# Altium schematic sheet STLINK-V2.SchDoc
size A
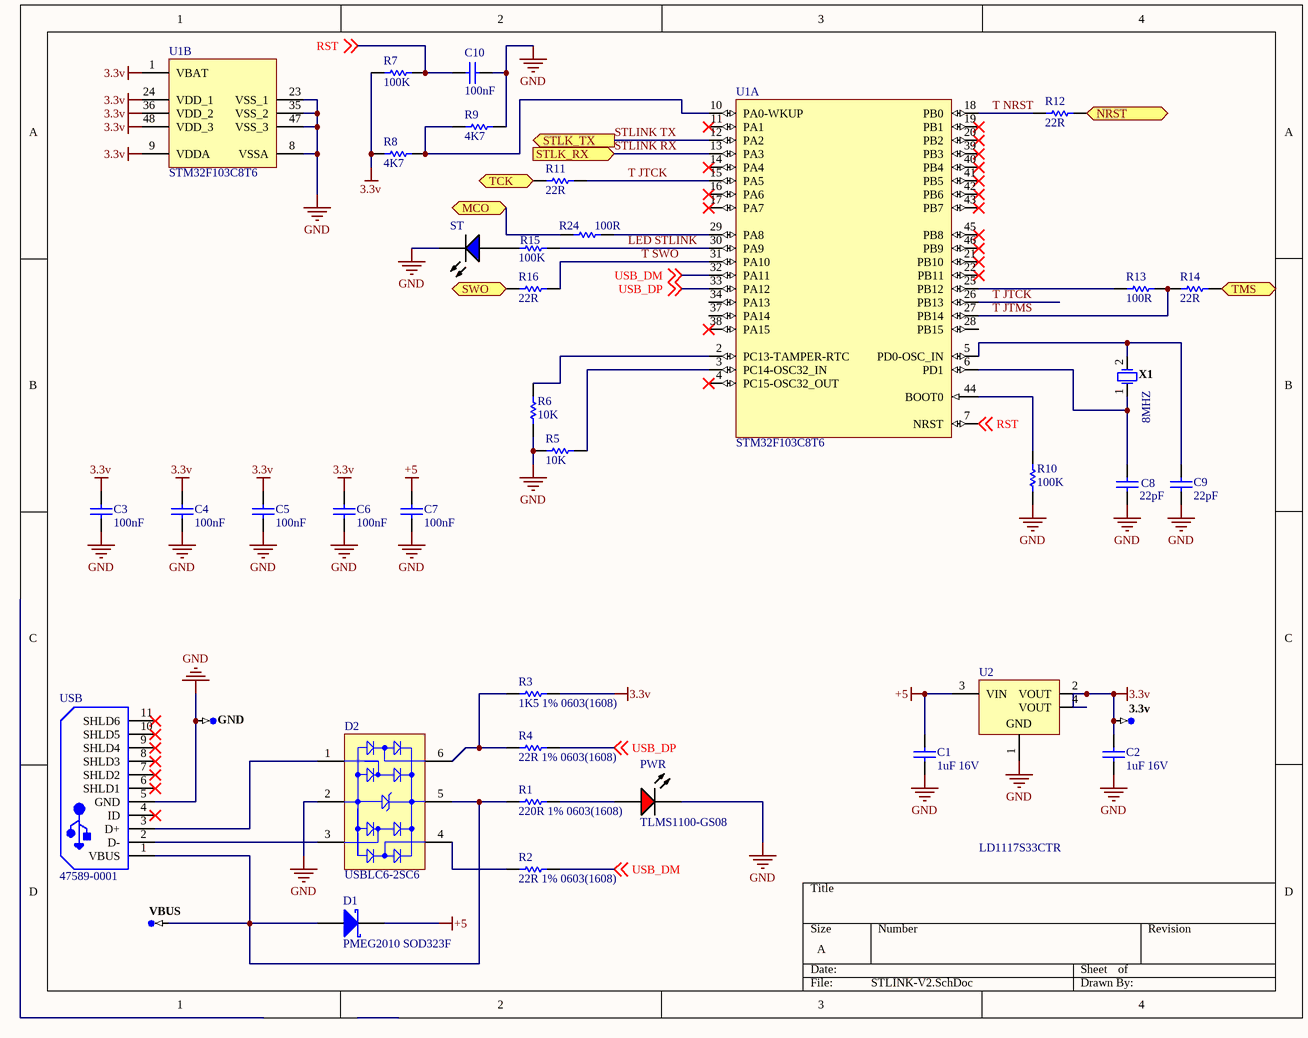
[diagram p0: STLINK-V2.SchDoc]

## Parts
3.3v  (no value)  [TP-SM-C-100]  (no BOM)
C1  1uF 16V  [CAPC0603(1608)100_L]
C2  1uF 16V  [CAPC0603(1608)100_L]
C3  100nF  [CAPC0603(1608)100_L]
C4  100nF  [CAPC0603(1608)100_L]
C5  100nF  [CAPC0603(1608)100_L]
C6  100nF  [CAPC0603(1608)100_L]
C7  100nF  [CAPC0603(1608)100_L]
C8  22pF  [CAPC0603(1608)100_L]
C9  22pF  [CAPC0603(1608)100_L]
C10  100nF  [CAPC0603(1608)100_L]
D1  PMEG2010 SOD323F  [NXP-SOD323F_V]
D2  USBLC6-2SC6  [STM-SOT23-6L_V]
GND  (no value)  [TP-SM-C-100]  (no BOM)
PWR  TLMS1100-GS08  [VISH-TLMX1100_V]
R1  220R 1% 0603(1608)  [RESC0603(1608)_L]
R2  22R 1% 0603(1608)  [RESC0603(1608)_L]
R3  1K5 1% 0603(1608)  [RESC0603(1608)_L]
R4  22R 1% 0603(1608)  [RESC0603(1608)_L]
R5  10K  [RESC1609X55X30LL15T15]
R6  10K  [RESC1609X55X30LL15T15]
R7  100K  [RESC0603(1608)_L]
R8  4K7  [RESC0603(1608)_L]
R9  4K7  [RESC0603(1608)_L]
R10  100K  [RESC0603(1608)_L]
R11  22R  [RESC0603(1608)_L]
R12  22R  [RESC0603(1608)_L]
R13  100R  [RESC0603(1608)_L]
R14  22R  [RESC0603(1608)_L]
R15  100K  [RESC0603(1608)_L]
R16  22R  [RESC0603(1608)_L]
R24  100R  [RESC0603(1608)_L]
ST  (no value)  [ROHM-SMLE12BC7TT86_V]
U1  STM32F103C8T6  [LQFP48_N]  (parts A,B of 2)
U2  LD1117S33CTR  [SOT-223_N]
USB  47589-0001  [MOLX-47589-0001_V]
VBUS  (no value)  [TP-SM-C-100]  (no BOM)
X1  8MHZ  [NDK-NX3225GD-8MHZ-STD-CRA-3_V]

## Ports
MCO (bidir), NRST (bidir), STLK_RX (in), STLK_TX (out), SWO (bidir), TCK (bidir), TMS (bidir)

## Nets
3.3v: 3.3v.1 C2.2 C3.2 C4.2 C5.2 C6.2 R3.2 R7.1 R8.1 U1.1(VBAT) U1.9(VDDA) U1.24(VDD_1) U1.36(VDD_2) U1.48(VDD_3) U2.2(VOUT) U2.4(VOUT)
+5: C1.2 C7.2 D1.1(K) U2.3(VIN)
GND: C1.1 C2.1 C3.1 C4.1 C5.1 C6.1 C7.1 C8.1 C9.1 C10.1 D2.2(GND) GND.1 PWR.2(K) R5.1 R6.1 R9.2 R10.1 ST.2(K) U1.8(VSSA) U1.23(VSS_1) U1.35(VSS_2) U1.47(VSS_3) U2.1(GND) USB.5(GND)
LED STLINK: R15.2 U1.30(PA9)
MCO: R24.1 ; port MCO
NRST: R12.2 ; port NRST
RST: C10.2 R7.2 U1.7(NRST) ; off-sheet RST
STLINK RX: U1.13(PA3) ; port STLK_RX
STLINK TX: U1.12(PA2) ; port STLK_TX
SWO: R16.1 ; port SWO
T JTCK: R11.2 U1.15(PA5) U1.26(PB13)
T JTMS: R13.2 R14.1 U1.27(PB14)
T NRST: R12.1 U1.18(PB0)
T SWO: R16.2 U1.31(PA10)
TCK: R11.1 ; port TCK
TMS: R14.2 ; port TMS
USB_DM: R2.2 U1.32(PA11) ; off-sheet USB_DM
USB_DP: R4.2 U1.33(PA12) ; off-sheet USB_DP
NetC8_2: C8.2 U1.6(PD1) X1.1
NetC9_2: C9.2 U1.5(PD0-OSC_IN) X1.2
NetD1_2: D1.2(A) D2.5(VBUS) R1.1 USB.1(VBUS) VBUS.1
NetD2_1: D2.1(I/O_1) USB.3(D+)
NetD2_3: D2.3(I/O_2) USB.2(D-)
NetD2_4: D2.4(I/O_3) R2.1
NetD2_6: D2.6(I/O_4) R3.1 R4.1
NetPWR_1: PWR.1(A) R1.2
NetR5_2: R5.2 U1.3(PC14-OSC32_IN)
NetR6_2: R6.2 U1.2(PC13-TAMPER-RTC)
NetR8_2: R8.2 R9.1 U1.10(PA0-WKUP)
NetR10_2: R10.2 U1.44(BOOT0)
NetR13_1: R13.1 U1.25(PB12)
NetR15_1: R15.1 ST.1(A)
NetR24_2: R24.2 U1.29(PA8)

Not connected (* = marked no-connect by the designer): U1 4(PC15-OSC32_OUT)* 11(PA1)* 14(PA4)* 16(PA6)* 17(PA7)* 19(PB1)* 20(PB2)* 21(PB10)* 22(PB11)* 28(PB15) 34(PA13) 37(PA14) 38(PA15)* 39(PB3)* 40(PB4)* 41(PB5)* 42(PB6)* 43(PB7)* 45(PB8)* 46(PB9)*; USB 4(ID)* 6(SHLD1)* 7(SHLD2)* 8(SHLD3)* 9(SHLD4)* 10(SHLD5)* 11(SHLD6)*

## Library data of the parts
3.3v GND VBUS = CMP-0484-00002-2: Test Point, Surface Mount, Circular, Pad Diameter 1 mm; Manufacturer: No Vendor; PartNumber: TP-SM-C-100
C1 C2 = CMP-1035-02736-1: CAP 1uF 16V ±5% 0603 (1608 Metric) Thickness 1mm SMD; Case-Metric: 1608; Case-EIA: 0603; Tolerance: Â±5%; Technology: SMT; Max Thickness: 1 mm; Rated Voltage: 16 V; Value: 1uF
C3-C7 C10 = CMP-1035-02583-1: CAP 100nF 16V ±5% 0603 (1608 Metric) Thickness 1mm SMD; Tolerance: Â±5%; Case-Metric: 1608; Case-EIA: 0603; Rated Voltage: 16 V; Max Thickness: 1 mm; Technology: SMT; Value: 100nF
C8 C9 = CMP-1035-00815-1: CAP 22pF 25V ±10% 0603 (1608 Metric) Thickness 1mm SMD; Case-Metric: 1608; Case-EIA: 0603; Tolerance: Â±10%; Max Thickness: 1 mm; Rated Voltage: 25 V; Technology: SMT; Value: 22pF
D1 = CMP-2000-06909-1: Very Low Forward Voltage MEGA Schottky Barrier Rectifier, 1 A, 660 mV, -65 to 150 degC, 2-Pin SOD323F, RoHS, Tape and Reel; Manufacturer: NXP; Speed: FastRecovery=200mA(Io); Package Version: 02/2016; Capacitance @ Vr, F: 68pF@1V,1MHz; PCN Design/Specification: ResinHardener02/Jul/2013BondWiringChg06/Sep/2015BondingWireRevision28/Sep/2015SOD323FBondWireAutoCu&2ndSourceMoldComp2/Nov/2015; Current - Average Rectified (Io): 1A(DC); Other Names: 568-4138-1; Voltage - Forward (Vf) (Max) @ If: 660mV@1A; Current - Reverse Leakage @ Vr: 50µA@60V; Online Catalog: SchottkyDiode; Kits: NXPMEGA1-KIT-ND-KITSCHOTTKYDIODE17VALUES; PCN Packaging: LighterReels02/Jan/2014; Voltage - DC Reverse (Vr) (Max): 60V; Diode Type: Schottky; Package Description: 2-Pin Small Outline Diode Flat Lead, Body 1.7 x 1.35 mm; Datasheet URL: https://datasheet.ciiva.com/913/pmeg6010ceh-pmeg6010cej-913504.pdf; Mounting Technology: SurfaceMount; Package Reference: SOD323F; Packaging: CutTape(CT); Manufacturer URL: http://www.nxp.com/; Supplier Device Package: SOD-323F; Reverse Recovery Time (trr): -; Standard Package: 1; Category: DiscreteSemiconductorProducts; Family: Diodes,Rectifiers-Single; Mounting Type: SurfaceMount; Datasheet Version: Rev. 02, 03/2007; Operating Temperature - Junction: 150°C(Max); Series: -; Package / Case: SC-90,SOD-323F; Package URL: http://www.nxp.com/documents/outline_drawing/SOD323F.pdf
D2 = CMP-2000-05378-1: Very low capacitance ESD protection, 3.5 pF, -40 to 125 degC, 6-Pin SOT23, RoHS, Tape and Reel; Manufacturer: STMicroelectronics; Polarity: Uni-Directional; Clamping Voltage: 17V; Rad Hardened: No; Product Height (mm): 1.3mm; Leakage Current (Max): 0.15uA; Product Length (mm): 3.05mm; Number of Elements: 1; Peak Pulse Current: 5A; Configuration: Dual; Reverse Breakdown Voltage: 6V; Working Voltage (Max): 5V; Capacitance Value: 3.5pF; Suppressor Type: DiodeArrays; Product Depth (mm): 1.75mm; Test Current (It): 1mA; Package / Case: SOT-23; Operating Temperature Max Deg. C: 125C; Package Description: 6-Pin Small Outline Transistor, Body 2.925 x 1.625 mm, Pitch 0.95 mm; Package Reference: SOT23-6L; Datasheet Version: Rev. 5, 10/2011; Operating Temperature Min Deg. C: -40C; Mounting Style: SurfaceMount; Direction Type: Uni-Directional; Mounting: SurfaceMount; Pin Count: 6; Leakage Current: 0.15uA; Packaging: TapeandReel; Operating Temperature Classification: Automotive; Clamping Voltage (Max): 17V; Manufacturer URL: http://www.st.com/; Reverse Stand-off Voltage: 5V; Datasheet URL: http://www.st.com/st-web-ui/static/active/en/resource/technical/document/datasheet/CD00050750.pdf; Working Voltage: 5V; Operating Temp Range: -40Cto125C
PWR = CMP-1666-00027-1: LED, RED, 2.1 V, -40 to 100 degC, 2-Pin SMD (0603), RoHS, Tape and Reel; Type (Capacitors): C0G; Resistance: 100000000000 Ohm; Capacitance: 12 pF; Voltage Rating: 50 V; Tolerance: 5%; Min Operating Temperature: -55degC; REACH SVHC: No SVHC; ComponentLink2Description: Datasheet; ComponentLink1URL: http://www.vishay.com/; Width: 0.8 mm; Package Quantity: 4000; PackageReference: TLMX1100; ComponentLink2URL: http://www.vishay.com/docs/83173/tlmb1100.pdf; Case/Package: 0603; Case Code (Metric): 1608; Packaging: Tape and Reel; Pins: 2; ComponentLink1Description: Manufacturer URL; Max Operating Temperature: 125degC; Height: 0.8 mm; Length: 1.6 mm; Mount: Surface Mount; PackageDescription: 2-Pin Surface Mount Device, Body 1.6 x 0.8 mm; DatasheetVersion: Rev. 2.7, 03/2016; Case Code (Imperial): 0603; Voltage Rating (DC): 50 V; RoHSCompliant: True; Radiation Hardening: No
R1 = CMP-1012-00433-1: 220R 0.1W 1% 0603 (1608 Metric)  SMD; Value: 220.00 Ohm; Case-EIA: 0603; Case-Metric: 1608; Technology: SMT; Tolerance: 1 %; Power: 0.1 W
R2 R4 R11 R12 R14 R16 = CMP-1012-00320-1: 22R 0.1W 1% 0603 (1608 Metric)  SMD; Value: 22.00 Ohm; Case-EIA: 0603; Case-Metric: 1608; Power: 0.1 W; Technology: SMT; Tolerance: 1 %
R3 = CMP-1012-00528-1: 1K5 0.1W 1% 0603 (1608 Metric)  SMD; Case-EIA: 0603; Value: 1500.00 Ohm; Case-Metric: 1608; Power: 0.1 W; Technology: SMT; Tolerance: 1 %
R5 R6 = CMP-2000-07452-1: Chip Resistor, 10 KOhm, +/- 1%, 0.1 W, -55 to 155 degC, 0603 (1608 Metric), RoHS, Tape and Reel; Manufacturer: Panasonic; Voltage Rating: 75V; Case\/Package: 0603; Power Rating: 100mW; Resistance: 10KOhm; Temperature Coefficient: 100ppm\/degreesC; Number of Pins: 2; Package Reference: 603; Depth: 0.8mm; Mount: SurfaceMount; Package Description: 2-Pin Surface Mount Device, Body 1.6 x 0.85 mm; Datasheet Version: 02/2017; Length: 1.6mm; Lead Free: LeadFree; Height: 0.45mm; Number of Terminations: 2; Max Power Dissipation: 100mW; Min Operating Temperature: -55degC; Datasheet URL: https://industrial.panasonic.com/cdbs/www-data/pdf/RDA0000/AOA0000C304.pdf; Termination: SMD/SMT; Case Code (Metric): 1608; Case Code (Imperial): 0603; Tolerance: 1%; Max Operating Temperature: 155degC; RoHSCompliant: true; Voltage Rating (DC): 75V; Radiation Hardening: No; Packaging: TapeandReel; Composition: ThickFilm; Mounting Technology: SurfaceMount; Manufacturer URL: http://www.panasonic.com/; Width: 0.031inch; REACH SVHC: NoSVHC; Contact Plating: Tin; Military Standard: Not; Package Quantity: 1
R7 R10 R15 = CMP-1012-00736-1: 100K 0.1W 1% 0603 (1608 Metric)  SMD; Value: 100000.00 Ohm; Case-Metric: 1608; Case-EIA: 0603; Power: 0.1 W; Tolerance: 1 %; Technology: SMT
R8 R9 = CMP-1012-00586-1: 4K7 0.1W 1% 0603 (1608 Metric)  SMD; Case-EIA: 0603; Case-Metric: 1608; Value: 4700.00 Ohm; Power: 0.1 W; Tolerance: 1 %; Technology: SMT
R13 R24 = CMP-1012-00397-1: 100R 0.1W 1% 0603 (1608 Metric)  SMD; Value: 100.00 Ohm; Case-EIA: 0603; Case-Metric: 1608; Technology: SMT; Tolerance: 1 %; Power: 0.1 W
ST = CMP-2000-07118-1: Blue LED, 2.9 V, 20 mA, -30 to 85 degC, 2-Pin SMD, RoHS, Tape and Reel; Manufacturer: Rohm; Lens Type: Clear; Viewing Angle: 140°; Forward Voltage: 2.9V; Forward (Drive) Current: 20mA; Intensity: 22mcd; Datasheet Version: Rev. 2.0, 03/2010; Package Description: 2-Pin Surface Mount Device, Body 1.6 x 0.8 mm; Mounting Technology: SurfaceMount; Dimension: 1.6x0.8x0.36mm; Package Reference: 1608; Datasheet URL: https://datasheet.ciiva.com/11773/0900766b80df3ad8-11773825.pdf; Color: Blue; Manufacturer URL: http://www.rohm.com/web/global/
U1 = CMP-0237-00215-1: STM32 ARM-based 32-bit MCU Performance Line with 64 kB Flash, 20 kB Internal RAM, -40 to +85°C Temperature, 48-Pin LQFP, Tray; ComponentLink2Description: STM32 Family Web Page; PackageReference: LQFP48; ComponentLink1Description: STM32F103 Datasheet; ComponentLink2URL: www.st.com/stm32; PackageDescription: 48-Pin Low-Profile Quad Flat Pack, 7 x 7 mm Body, 0.5 mm Pitch (LQFP48); DatasheetVersion: rev13.0, Apr-2011; ComponentLink1URL: http://www.st.com/internet/com/TECHNICAL_RESOURCES/TECHNICAL_LITERATURE/DATASHEET/CD00161566.pdf; ComponentLink3Description: st.com Home; ComponentLink3URL: http://www.st.com/internet/com/home/home.jsp; PackageVersion: rev13, Apr-2011; PartId: 1
U2 = CMP-0244-00307-1: Fixed Low Drop Positive Voltage Regulator, 3.3V, 4-Pin SOT-223, Tape and Reel; ComponentLink1URL: http://www.st.com; PackageVersion: 2010; ComponentLink1Description: Manufacturer URL; DatasheetVersion: 1/11/2011; ComponentLink2URL: http://www.st.com/internet/com/TECHNICAL_RESOURCES/TECHNICAL_LITERATURE/DATASHEET/CD00000544.pdf; PackageReference: SOT-223; ComponentLink2Description: Datasheet; PackageDescription: 4-Pin SOT-223 Package, 6.5 x 3.5 mm Body, 2.3 mm Pitch, 7 mm Lead Span
USB = CMP-2000-05610-1: Right Angle Female Type AB Micro USB Connector, 30 V, 1.8 A, -30 to 85 degC, RoHS, Tape and Reel; Number of Ports: 1Port; Current Rating: 1.8A; Brand: Molex; Connector Type: MicroUSBTypeABreceptacle; Number of Contacts: 5Contact; Voltage Rating: 30VAC; Color: Black; Product: MicroUSBTypeABConnectors; Package URL: http://www.molex.com/pdm_docs/sd/475890001_sd.pdf; Contact Plating: Gold; Datasheet URL: http://www.molex.com/webdocs/datasheets/pdf/en-us/0475890001_IO_CONNECTORS.pdf; Operating Temperature Range: -20Cto+85C; Termination Style: SMD/SMT; Mounting Angle: Right; Package Reference: 47589-0001; Gender: Female; Package Description: Micro USB Connector, Pitch 0.65 mm, 5 Positions, Body 7.5 x 5.6 mm; Mounting Technology: SurfaceMount; Contact Material: CopperAlloy; Packaging: Reel; RoHS: True; Standard: USB; Manufacturer URL: http://www.molex.com/; Manufacturer: Molex; Datasheet Version: 12/2016; Product Category: USBConnectors; Series: 47589
X1 = CMP-2000-07595-1: Crystal Unit, 8 MHz, 8 pF, -40 to 150 degC, 2-Pin SMD, RoHS, Tape and Reel; Manufacturer: NDK; Load Capacitance: 8pF; ESR (Equivalent Series Resistance): 500Ohm; Frequency Tolerance: 50ppm; Frequency Stability: 150ppm; Case/Package: SMD/SMT; Datasheet Version: 11/2016; Min Operating Temperature: -40degC; Packaging: TapeandReel; Width: 0.098inch; Package Quantity: 3000; Number of Pins: 2; Package Description: 2-Pin Surface Mount Device, Body 3.2 x 2.5 mm; RoHSCompliant: True; Package Reference: NX3225GD-8MHZ-STD-CRA-3; Datasheet URL: http://www.ndk.com/images/products/catalog/c_NX3225GD-STD-CRA-3_e.pdf; Mounting Technology: SurfaceMount; Length: 0.126inch; Mount: SurfaceMount; Manufacturer URL: http://www.ndk.com/en/; Max Operating Temperature: 150degC; Frequency: 8MHz; Height: 0.039inch